# Altium schematic sheet Watch-Sheet.SchDoc
size A4
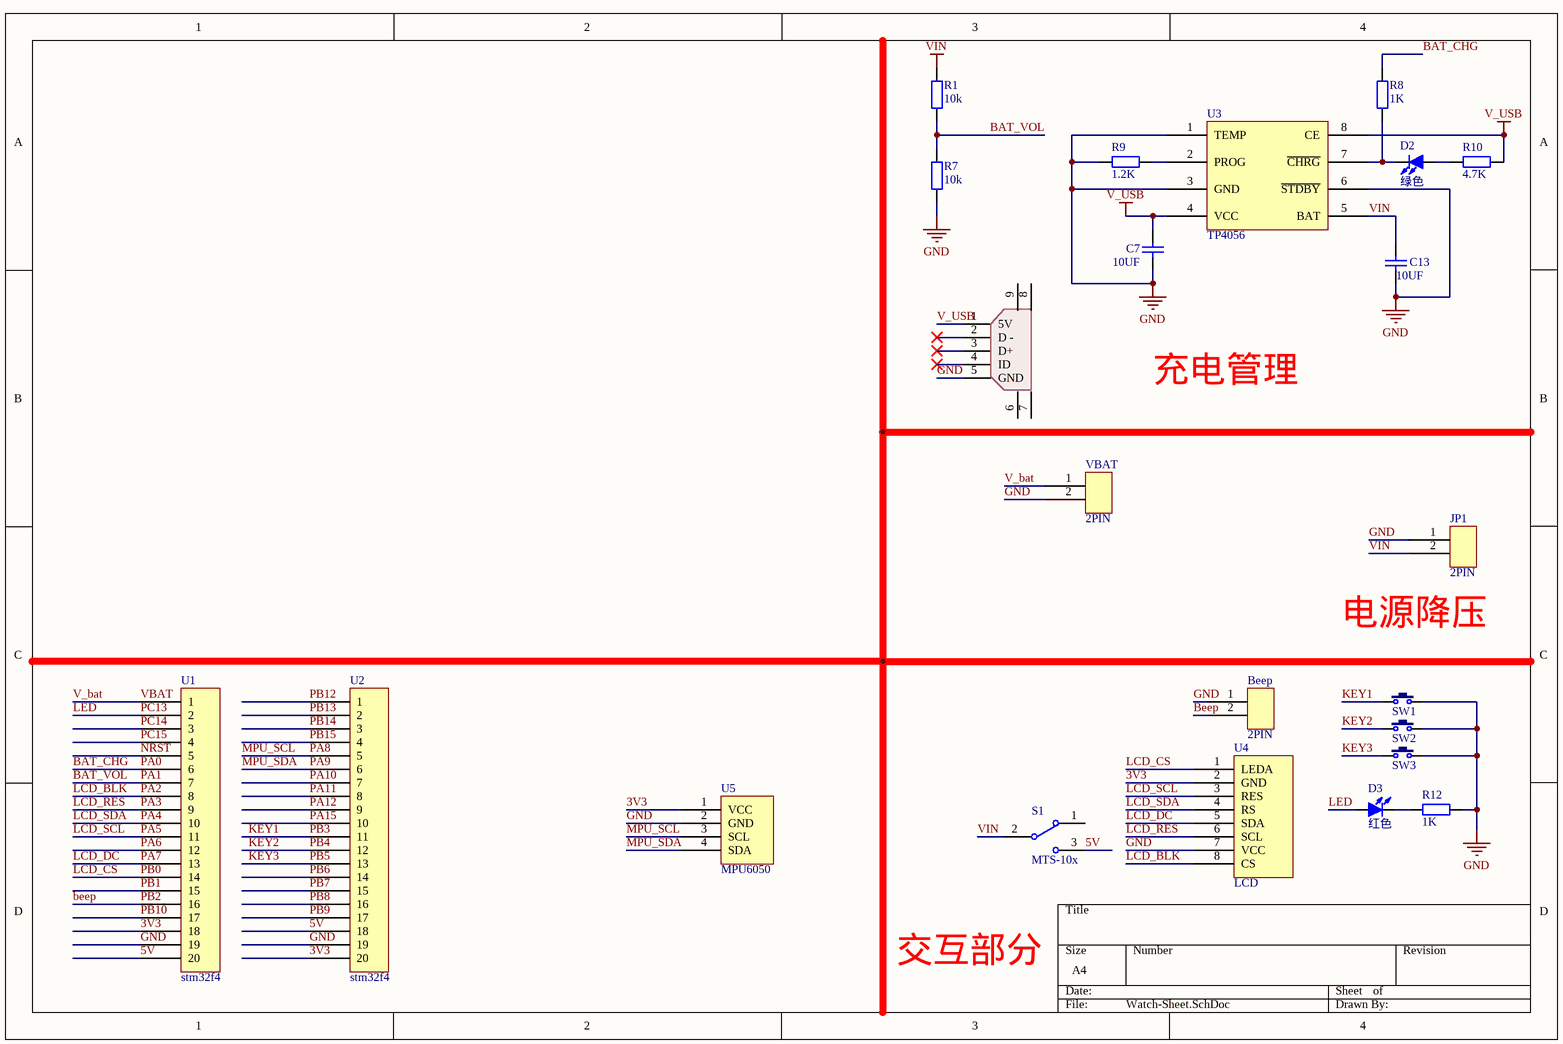
[diagram p0: Watch-Sheet.SchDoc]

## Parts
?  Micro USB  [USB-micro_A]  (value not drawn)
Beep  2PIN  [5020beep]
C7  10UF  [C 0603_L]
C13  10UF  [C 0603_L]
D2  绿色  [LED 0603R]
D3  红色  [LED 0603R]
JP1  2PIN  [2PIN]
R1  10k  [R 0603_L]
R7  10k  [R 0603_L]
R8  1K  [R 0603_L]
R9  1.2K  [R 0603_L]
R10  4.7K  [R 0603_L]
R12  1K  [R 0603_L]
S1  MTS-10x  [MSK-12C01-07]
SW1  3x6x5  [TSW 3*6*4.3-S-W]  (value not drawn)
SW2  3x6x5  [TSW 3*6*4.3-S-W]  (value not drawn)
SW3  3x6x5  [TSW 3*6*4.3-S-W]  (value not drawn)
U1  stm32f4  [HDR2.54-LI-20P]
U2  stm32f4  [HDR2.54-LI-20P]
U3  TP4056  [SOP8]
U4  LCD  [FPC0.5 2H-WS-8P]
U5  MPU6050  [HDR2.54-LI-4P]
VBAT  2PIN  [2PIN]

## Nets
GND: ?.5(GND) Beep.1 C7.1 C13.1 JP1.1 R7.1 R9.1 R12.2 SW1.2 SW2.2 SW3.2 U1.19 U2.19 U3.1(TEMP) U3.3(GND) U3.6(~{STDB}~{Y}) U4.7(VCC) U5.2(GND) VBAT.2
V_USB: ?.1(5V) C7.2 R10.2 U3.4(VCC) U3.8(CE)
VIN: C13.2 JP1.2 R1.2 S1.2 U3.5(BAT)
3V3: U1.18 U2.20 U4.2(GND) U5.1(VCC)
5V: S1.3 U1.20 U2.18
BAT_CHG: R8.2 U1.6  [also labelled PA0]
BAT_VOL: R1.1 R7.2 U1.7  [also labelled PA1]
Beep: Beep.2 U1.16  [also labelled PB2]
KEY1: SW1.1 U2.11  [also labelled PB3]
KEY2: SW2.1 U2.12  [also labelled PB4]
KEY3: SW3.1 U2.13  [also labelled PB5]
LCD_BLK: U1.8 U4.8(CS)  [also labelled PA2]
LCD_CS: U1.14 U4.1(LEDA)  [also labelled PB0]
LCD_DC: U1.13 U4.5(SDA)  [also labelled PA7]
LCD_RES: U1.9 U4.6(SCL)  [also labelled PA3]
LCD_SCL: U1.11 U4.3(RES)  [also labelled PA5]
LCD_SDA: U1.10 U4.4(RS)  [also labelled PA4]
LED: D3.1(A) U1.2  [also labelled PC13]
MPU_SCL: U2.5 U5.3(SCL)  [also labelled PA8]
MPU_SDA: U2.6 U5.4(SDA)  [also labelled PA9]
NRST: U1.5
PA6: U1.12
PA10: U2.7
PA11: U2.8
PA12: U2.9
PA15: U2.10
PB1: U1.15
PB6: U2.14
PB7: U2.15
PB8: U2.16
PB9: U2.17
PB10: U1.17
PB12: U2.1
PB13: U2.2
PB14: U2.3
PB15: U2.4
PC14: U1.3
PC15: U1.4
V_bat: U1.1 VBAT.1  [also labelled VBAT]
NetD2_1: D2.1(A) R10.1
NetD2_2: D2.2(K) R8.1 U3.7(~{CHRG})
NetD3_2: D3.2(K) R12.1
NetR9_2: R9.2 U3.2(PROG)

Not connected (* = marked no-connect by the designer): ? 2(D_-)* 3(D+)* 4(ID_)* 6 7 8 9; S1 1

## Notes on the sheet
- 充电管理
- 电源降压
- 交互部分

## Library data of the parts
C7 C13 = 0402 CAP
D2 D3 = LED-SMD: 贴片LED; 版权归属: 源创客; BOM名称: 贴片LED; 学习资源: www.ooocke.com
R1 R7-R10 R12 = R: 贴片电阻; 版权归属: 源创客; BOM名称: 贴片电阻; 学习资源: www.ooocke.com
S1 = MTS-10x: MTS10x系列3脚扭子开关; 版权归属: 源创客; BOM名称: MTS10x系列3脚扭子开关; 学习资源: www.ooocke.com
SW1-SW3 = TSW 3x6: 3x6轻触开关; 版权归属: 源创客; BOM名称: 3x6轻触开关; 学习资源: www.ooocke.com
U4 = LCD: 屏幕接口
U5 = MPU6050_